# Altium schematic sheet POW_to_BATTY_AUDIO_D.SchDoc
size A4
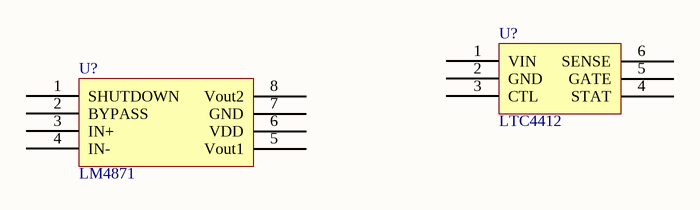
[diagram p0: POW_to_BATTY_AUDIO_D.SchDoc]

## Parts
(Parts that share a designator on the sheet are numbered #1, #2 ... from top to bottom, then left to right.)
U?#1  LTC4412  [LTC4412-TSOT-23]
U?#2  LM4871  [LM4871M-SOP8]

## Nets

Not connected (* = marked no-connect by the designer): U?#1 1(VIN) 2(GND) 3(CTL) 4(STAT) 5(GATE) 6(SENSE); U?#2 1(SHUTDOWN) 2(BYPASS) 3(IN+) 4(IN-) 5(Vout1) 6(VDD) 7(GND) 8(Vout2)